# Altium schematic sheet Top.SchDoc
size A4
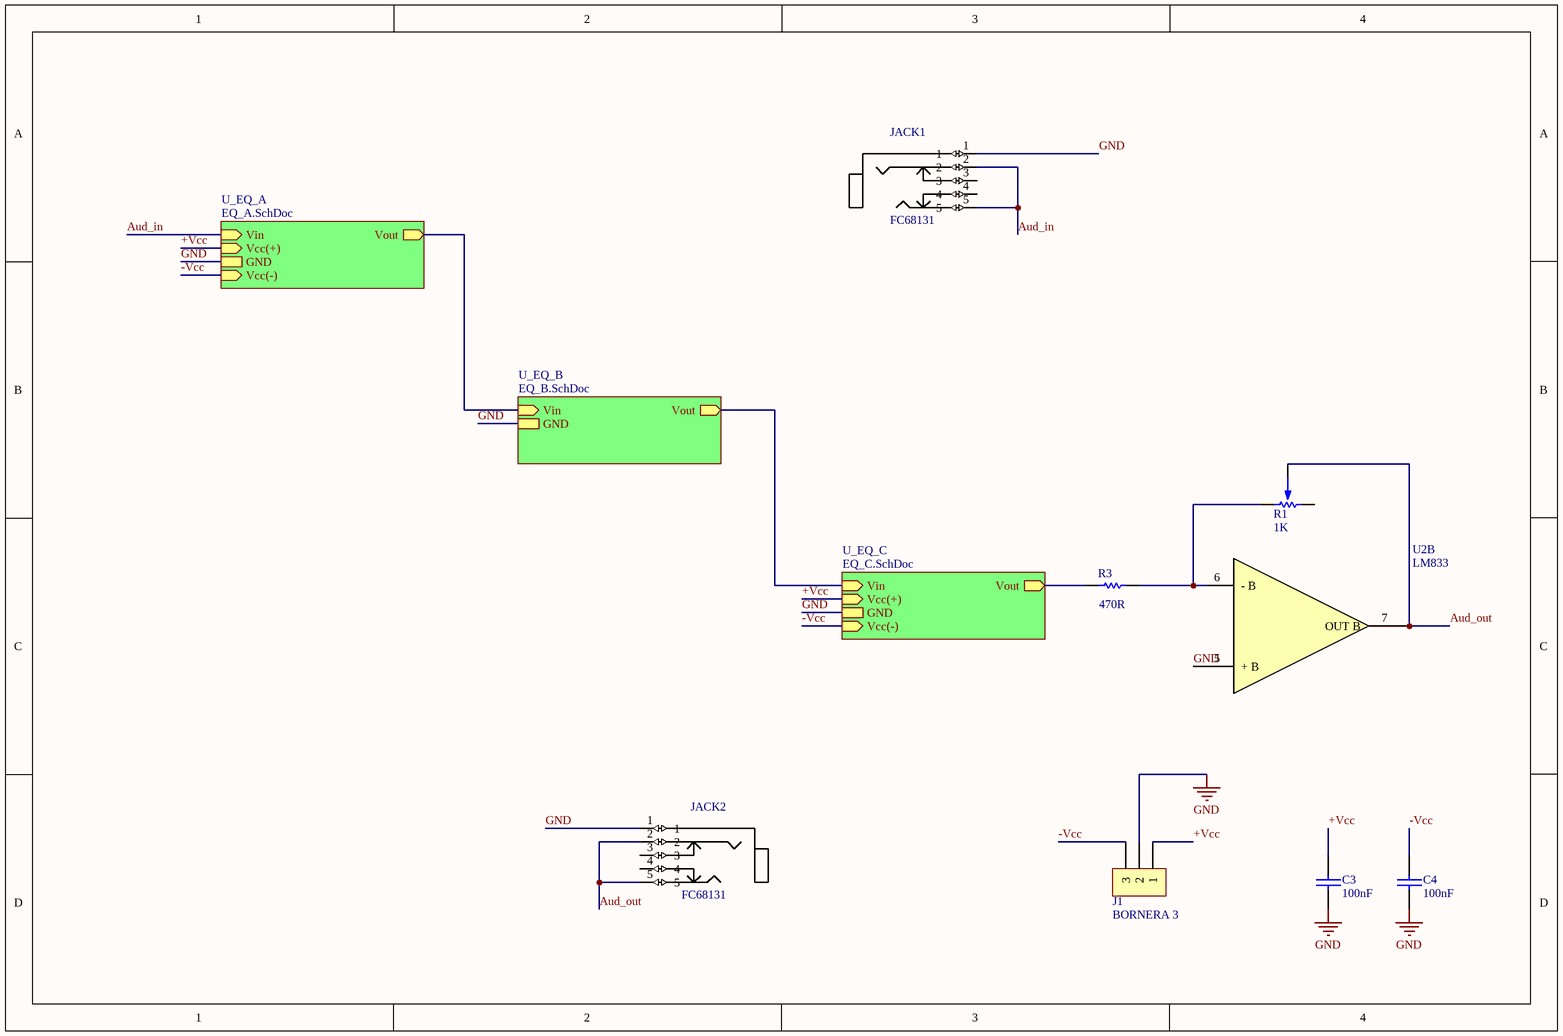
[diagram p0: Top.SchDoc]

## Parts
C3  100nF  [CAP200]
C4  100nF  [CAP200]
J1  BORNERA 3  [BORNERA3]
JACK1  FC68131  [*FC68131-5P]
JACK2  FC68131  [*FC68131-5P]
R1  1K  [POTENCIOMETRO]
R3  470R  [0805]
U2  LM833  [DIP8]  (part B of 2)

## Sub-sheets
U_EQ_A = EQ_A.SchDoc: Vin (in), Vout (out), Vcc(+) (in), GND, Vcc(-) (in)  | C1_value: 47nF; R3_value: 1M; POT_value: 100K; R1_value: 120R; C2_value: 470nF
U_EQ_B = EQ_B.SchDoc: Vin (in), Vout (out), GND  | POT_value: 1K; R3_value: 10K; R1_value: 120R; C2_value: 47nF; C1_value: 470nF
U_EQ_C = EQ_C.SchDoc: Vin (in), Vout (out), Vcc(+) (in), GND, Vcc(-) (in)  | POT_value: 1K; R3_value: 10K; R1_value: 150R; C2_value: 5.6nF; C1_value: 56nF

## Nets
GND: C3.2 C4.1 J1.2 JACK1.1 JACK2.1 U2.5(+_B) ; sheet U_EQ_A/GND, sheet U_EQ_B/GND, sheet U_EQ_C/GND
+Vcc: C3.1 J1.1 ; sheet U_EQ_A/Vcc(+), sheet U_EQ_C/Vcc(+)
-Vcc: C4.2 J1.3 ; sheet U_EQ_A/Vcc(-), sheet U_EQ_C/Vcc(-)
Aud_in: JACK1.2 JACK1.5 ; sheet U_EQ_A/Vin
Aud_out: JACK2.2 JACK2.5 R1.2 U2.7(OUT_B)
NetR1_1: R1.1 R3.2 U2.6(-_B)
NetR3_1: R3.1 ; sheet U_EQ_C/Vout
(unnamed): sheet U_EQ_A/Vout, sheet U_EQ_B/Vin
(unnamed): sheet U_EQ_B/Vout, sheet U_EQ_C/Vin

Not connected (* = marked no-connect by the designer): JACK1 3 4; JACK2 3 4; R1 3

## Library data of the parts
C3 C4 = CAP
JACK1 JACK2 = FC68131: Stereo Jack, 3.5mm, 3pos, Pcb; MF: Cliff; SnapEDA_Link: https://www.snapeda.com/parts/FC68131/Cliff%20Electronics/view-part/?ref=snap; MP: FC68131; Availability: Unavailable; Package: None; Price: None; Value: *
R1 = POTENCIOMETRO
R3 = RES
U2 = LM833: Dual Audio Operational Amplifier